# Altium schematic sheet Main.SchDoc
size A4; DocumentNumber: 1; SheetNumber: 2; SheetTotal: 5
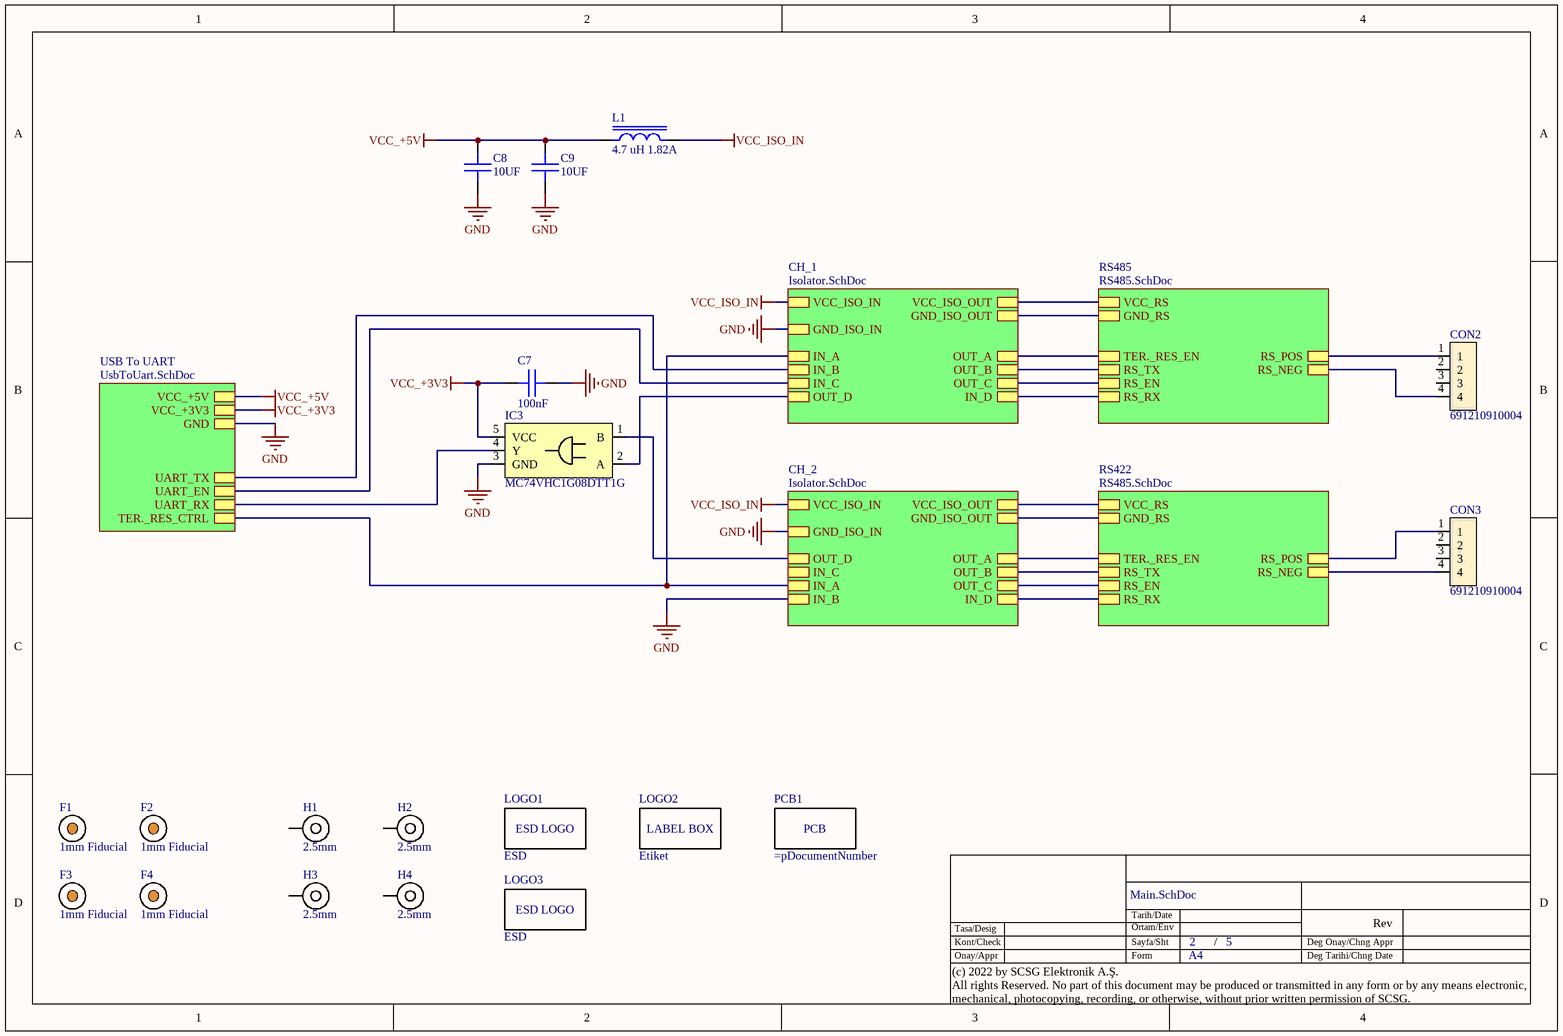
[diagram p0: Main.SchDoc]

## Parts
C7  100nF  [C0603]
C8  10UF  [c1206]
C9  10UF  [c1206]
CON2  691210910004  [691210910004]
CON3  691210910004  [691210910004]
F1  1mm Fiducial  [1mm Fiducial]  (no BOM)
F2  1mm Fiducial  [1mm Fiducial]  (no BOM)
F3  1mm Fiducial  [1mm Fiducial]  (no BOM)
F4  1mm Fiducial  [1mm Fiducial]  (no BOM)
H1  2.5mm  [2.5mm hole]  (no BOM)
H2  2.5mm  [2.5mm hole]  (no BOM)
H3  2.5mm  [2.5mm hole]  (no BOM)
H4  2.5mm  [2.5mm hole]  (no BOM)
IC3  MC74VHC1G08DTT1G  [SOT23-5]
L1  4.7 uH 1.82A  [WE-PD2_4532]
LOGO1  ESD  [ESD]  (no BOM)
LOGO2  Etiket  [ETIKET]  (no BOM)
LOGO3  ESD  [ESD]  (no BOM)
PCB1  (no value)  [PCB]

## Sub-sheets
CH_1 = Isolator.SchDoc: IN_A, IN_B, IN_C, OUT_D, OUT_A, OUT_B, OUT_C, IN_D, VCC_ISO_IN, GND_ISO_IN, VCC_ISO_OUT, GND_ISO_OUT
CH_2 = Isolator.SchDoc: IN_A, IN_B, IN_C, OUT_D, OUT_A, OUT_B, OUT_C, IN_D, VCC_ISO_IN, GND_ISO_IN, VCC_ISO_OUT, GND_ISO_OUT
RS422 = RS485.SchDoc: RS_RX, RS_TX, RS_EN, RS_POS, RS_NEG, GND_RS, VCC_RS, TER._RES_EN
RS485 = RS485.SchDoc: RS_RX, RS_TX, RS_EN, RS_POS, RS_NEG, GND_RS, VCC_RS, TER._RES_EN
USB To UART = UsbToUart.SchDoc: UART_RX, UART_TX, UART_EN, VCC_+3V3, GND, VCC_+5V, TER._RES_CTRL

## Nets
GND: C7.1 C8.1 C9.1 IC3.3(GND) ; sheet USB To UART/GND, sheet CH_1/GND_ISO_IN, sheet CH_2/IN_B, sheet CH_2/GND_ISO_IN
VCC_+3V3: C7.2 IC3.5(VCC) ; sheet USB To UART/VCC_+3V3
VCC_+5V: C8.2 C9.2 L1.1 ; sheet USB To UART/VCC_+5V
VCC_ISO_IN: L1.2 ; sheet CH_1/VCC_ISO_IN, sheet CH_2/VCC_ISO_IN
NetCON2_1: CON2.1 ; sheet RS485/RS_POS
NetCON2_4: CON2.4 ; sheet RS485/RS_NEG
NetCON3_1: CON3.1 ; sheet RS422/RS_POS
NetCON3_4: CON3.4 ; sheet RS422/RS_NEG
NetIC3_1: IC3.1(B) ; sheet CH_2/OUT_D
NetIC3_2: IC3.2(A) ; sheet CH_1/OUT_D
NetIC3_4: IC3.4(Y) ; sheet USB To UART/UART_RX
(unnamed): sheet USB To UART/UART_TX, sheet CH_1/IN_B
(unnamed): sheet USB To UART/UART_EN, sheet CH_1/IN_C
(unnamed): sheet USB To UART/TER._RES_CTRL, sheet CH_1/IN_A, sheet CH_2/IN_A
(unnamed): sheet RS485/RS_RX, sheet CH_1/IN_D
(unnamed): sheet RS485/RS_TX, sheet CH_1/OUT_B
(unnamed): sheet RS485/RS_EN, sheet CH_1/OUT_C
(unnamed): sheet RS485/GND_RS, sheet CH_1/GND_ISO_OUT
(unnamed): sheet RS485/VCC_RS, sheet CH_1/VCC_ISO_OUT
(unnamed): sheet RS485/TER._RES_EN, sheet CH_1/OUT_A
(unnamed): sheet RS422/RS_RX, sheet CH_2/IN_D
(unnamed): sheet RS422/RS_TX, sheet CH_2/OUT_B
(unnamed): sheet RS422/RS_EN, sheet CH_2/OUT_C
(unnamed): sheet RS422/GND_RS, sheet CH_2/GND_ISO_OUT
(unnamed): sheet RS422/VCC_RS, sheet CH_2/VCC_ISO_OUT
(unnamed): sheet RS422/TER._RES_EN, sheet CH_2/OUT_A

Not connected (* = marked no-connect by the designer): CON2 2 3; CON3 2 3; H1 1; H2 1; H3 1; H4 1

## Notes on the sheet
- Tarih/Date
- Tasa/Desig
- Kont/Check
- Onay/Appr
- Sayfa/Sht
- Form
- Ortam/Env
- A4
- /
- Deg Tarihi/Chng Date
- Deg Onay/Chng Appr
- Rev
- (c) 2022 by SCSG Elektronik A.Ş.
  All rights Reserved. No part of this document may be produced or transmitted in any form or by any means electronic, mechanical, photocopying, recording, or otherwise, without prior written permission of SCSG.
- (in symbol Etiket) LABEL BOX

## Library data of the parts
C7 = CC0603KRX7R8BB104: 100nF, 25V, X7R, 0603; Manufacturer: Yageo; Value: 100000; Tolerance: 10%; Dielectric Material: Ceramic; Purpose Of Usage: BASIC; Working Voltage: 0; Supplier 1: Digi-Key; Supplier Part Number 1: 311-1341-1-ND; Manufacturer Part Number: CC0603KRX7R8BB104; RoHS: YES; Mount: SMD; Case/Package: 0603; Case Code (Imperial): 0603; Case Code (Metric): 1608; Min Operating Temperature: -55°C; Max Operating Temperature: 125°C; Voltage Rating: 25V; Voltage Rating (DC): 25V; Dielectric: X7R; Height: 0.8mm; Category: CAPASITOR; Sub-Category: CERAMIC; Stock ID: ??; Local Supplier: GENERAL; Price 10K: 0.00250
C8 C9 = CL31B106MOHNNNE: 10UF, 16V, X7R, 1206; Manufacturer: Samsung; Value: 10000000; Tolerance: 20%; Dielectric Material: Ceramic; Purpose Of Usage: BASIC; Working Voltage: 0; Supplier 1: Digi-Key; Supplier Part Number 1: 1276-6641-1-ND; Manufacturer Part Number: CL31B106MOHNNNE; RoHS: YES; Mount: SMD; Case/Package: 1206; Case Code (Metric): 3216; Case Code (Imperial): 1206; Min Operating Temperature: -55°C; Max Operating Temperature: 125°C; Dielectric: X7R; Voltage Rating (DC): 16V; Voltage Rating: 16V; Category: CAPASITOR; Sub-Category: CERAMIC; Stock ID: ??; Local Supplier: GENERAL; Price 10K: 0.00250
CON2 CON3 = 691210910004: WR-TBL Terminal block - Rising Cage - THT; Manufacturer: Wurth Elektronik; Current Rating: 6A; Pitch: 2.54mm; Gender: Male; Number of Contacts: 4; Purpose Of Usage: BASIC; Manufacturer Part Number: 691210910004; RoHS: Compliant; Category: CONNECTORS; Length: 10.56mm; Max Operating Temperature: 105°C; Min Operating Temperature: -40°C; Color: Green; Local Supplier: WURTH; Mount: SMD; Stock ID: ??; Sub-Category: TERMINAL BLOCK; Supplier 1: Digi-Key; Supplier Part Number 1: 732-691210910004-ND
F1-F4 = 1mm Fiducial: Manufacturer Part Number: Fiducial 2mm; Purpose Of Usage: BASIC; Category: MECHANICAL; Sub-Category: FIDUCIAL; Manufacturer: --; Mount: NO MOUNT; Stock ID: ??
H1-H4 = 2.5 mm Hole: 2.5mm hole; Purpose Of Usage: BASIC; Category: MECHANICAL; Sub-Category: HOLE; Manufacturer: --; Manufacturer Part Number: --; Mount: NO MOUNT; Stock ID: ??
IC3 = MC74VHC1G08DTT1G: MC74VHC1G08 Series 2 to 5.5 SMT Single 2 Input AND Gate - SOT-23-5; Manufacturer: ON Semiconductor; Max Supply Voltage: 5.5V; Min Supply Voltage: 2V; Purpose Of Usage: BASIC; Manufacturer Part Number: MC74VHC1G08DTT1G; RoHS: YES; Category: INTEGRATED CIRCUITS; Case/Package: SOT-23-5; Min Operating Temperature: -55°C; Max Operating Temperature: 125°C; Package Quantity: 1; Lead Free: Lead Free; Supplier 1: Digi-Key; Supplier Part Number 1: MC74VHC1G08DTT1GOSTR-ND; Mount: SMD; MSL: 1; Stock ID: ??; Sub-Category: LOGIC
L1 = 744773047: WE-PD2, Unshielded Wire-wound SMD Inductor With Ferrite Core, 4.7 Uh, 1.82A I; Manufacturer: Wurth Elektronik; DC Resistance (DCR): 59mΩ; Value: 4.7µH; Inductance Tolerance: 20%; Saturation Current: 2.9A; Self Resonant Frequency: 45MHz; Test Frequency: 10kHz; Manufacturer Part Number: 744773047; RoHS: YES; Category: INDUCTORS; Case/Package: SMD/SMT; Current Rating: 1.82A; Height: 3.2mm; Length: 4mm; Max DC Current: 1.82A; Max Operating Temperature: 125°C; Min Operating Temperature: -40°C; RMS Current (Irms): 1.82A; Shielding: Unshielded; Mount: SMD; Stock ID: ??; Sub-Category: FIXED INDUCTORS; Supplier 1: Digi-Key; Supplier Part Number 1: 732-1252-1-ND
LOGO1 LOGO3 = ESD: ESD LOGO; Purpose Of Usage: BASIC; Category: MECHANICAL; Sub-Category: LOGO; Manufacturer: --; Manufacturer Part Number: ESD; Mount: NO MOUNT; Stock ID: ??
LOGO2 = Etiket: Etiket kutu; Purpose Of Usage: BASIC; Category: MECHANICAL; Sub-Category: LOGO; Manufacturer: --; Manufacturer Part Number: Etiket; Mount: NO MOUNT; Stock ID: ??
PCB1 = PCB: Manufacturer: CUSTOM; Purpose Of Usage: BASIC; Category: MECHANICAL; Local Supplier: CUSTOM; Manufacturer Part Number: CUSTOM; Mount: MECH; Price 10K: 0.25; Stock ID: ??; Sub-Category: PCB; Supplier 1: CUSTOM; Supplier Part Number 1: CUSTOM